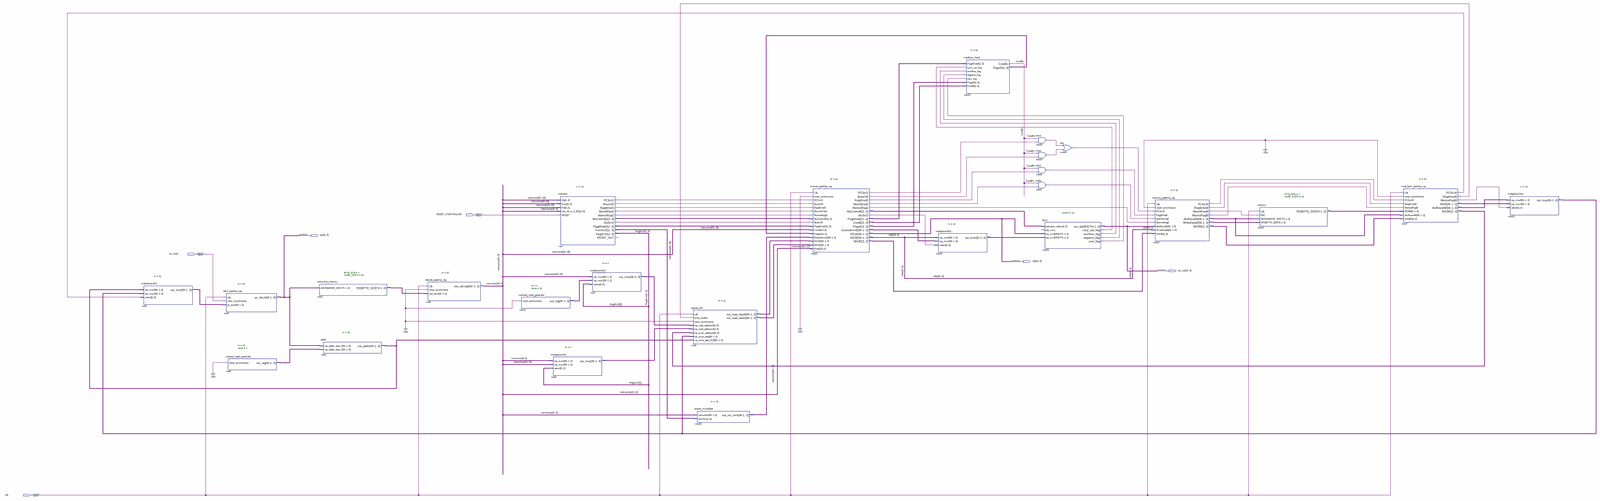
[diagram p0: schematic sheet, whole]
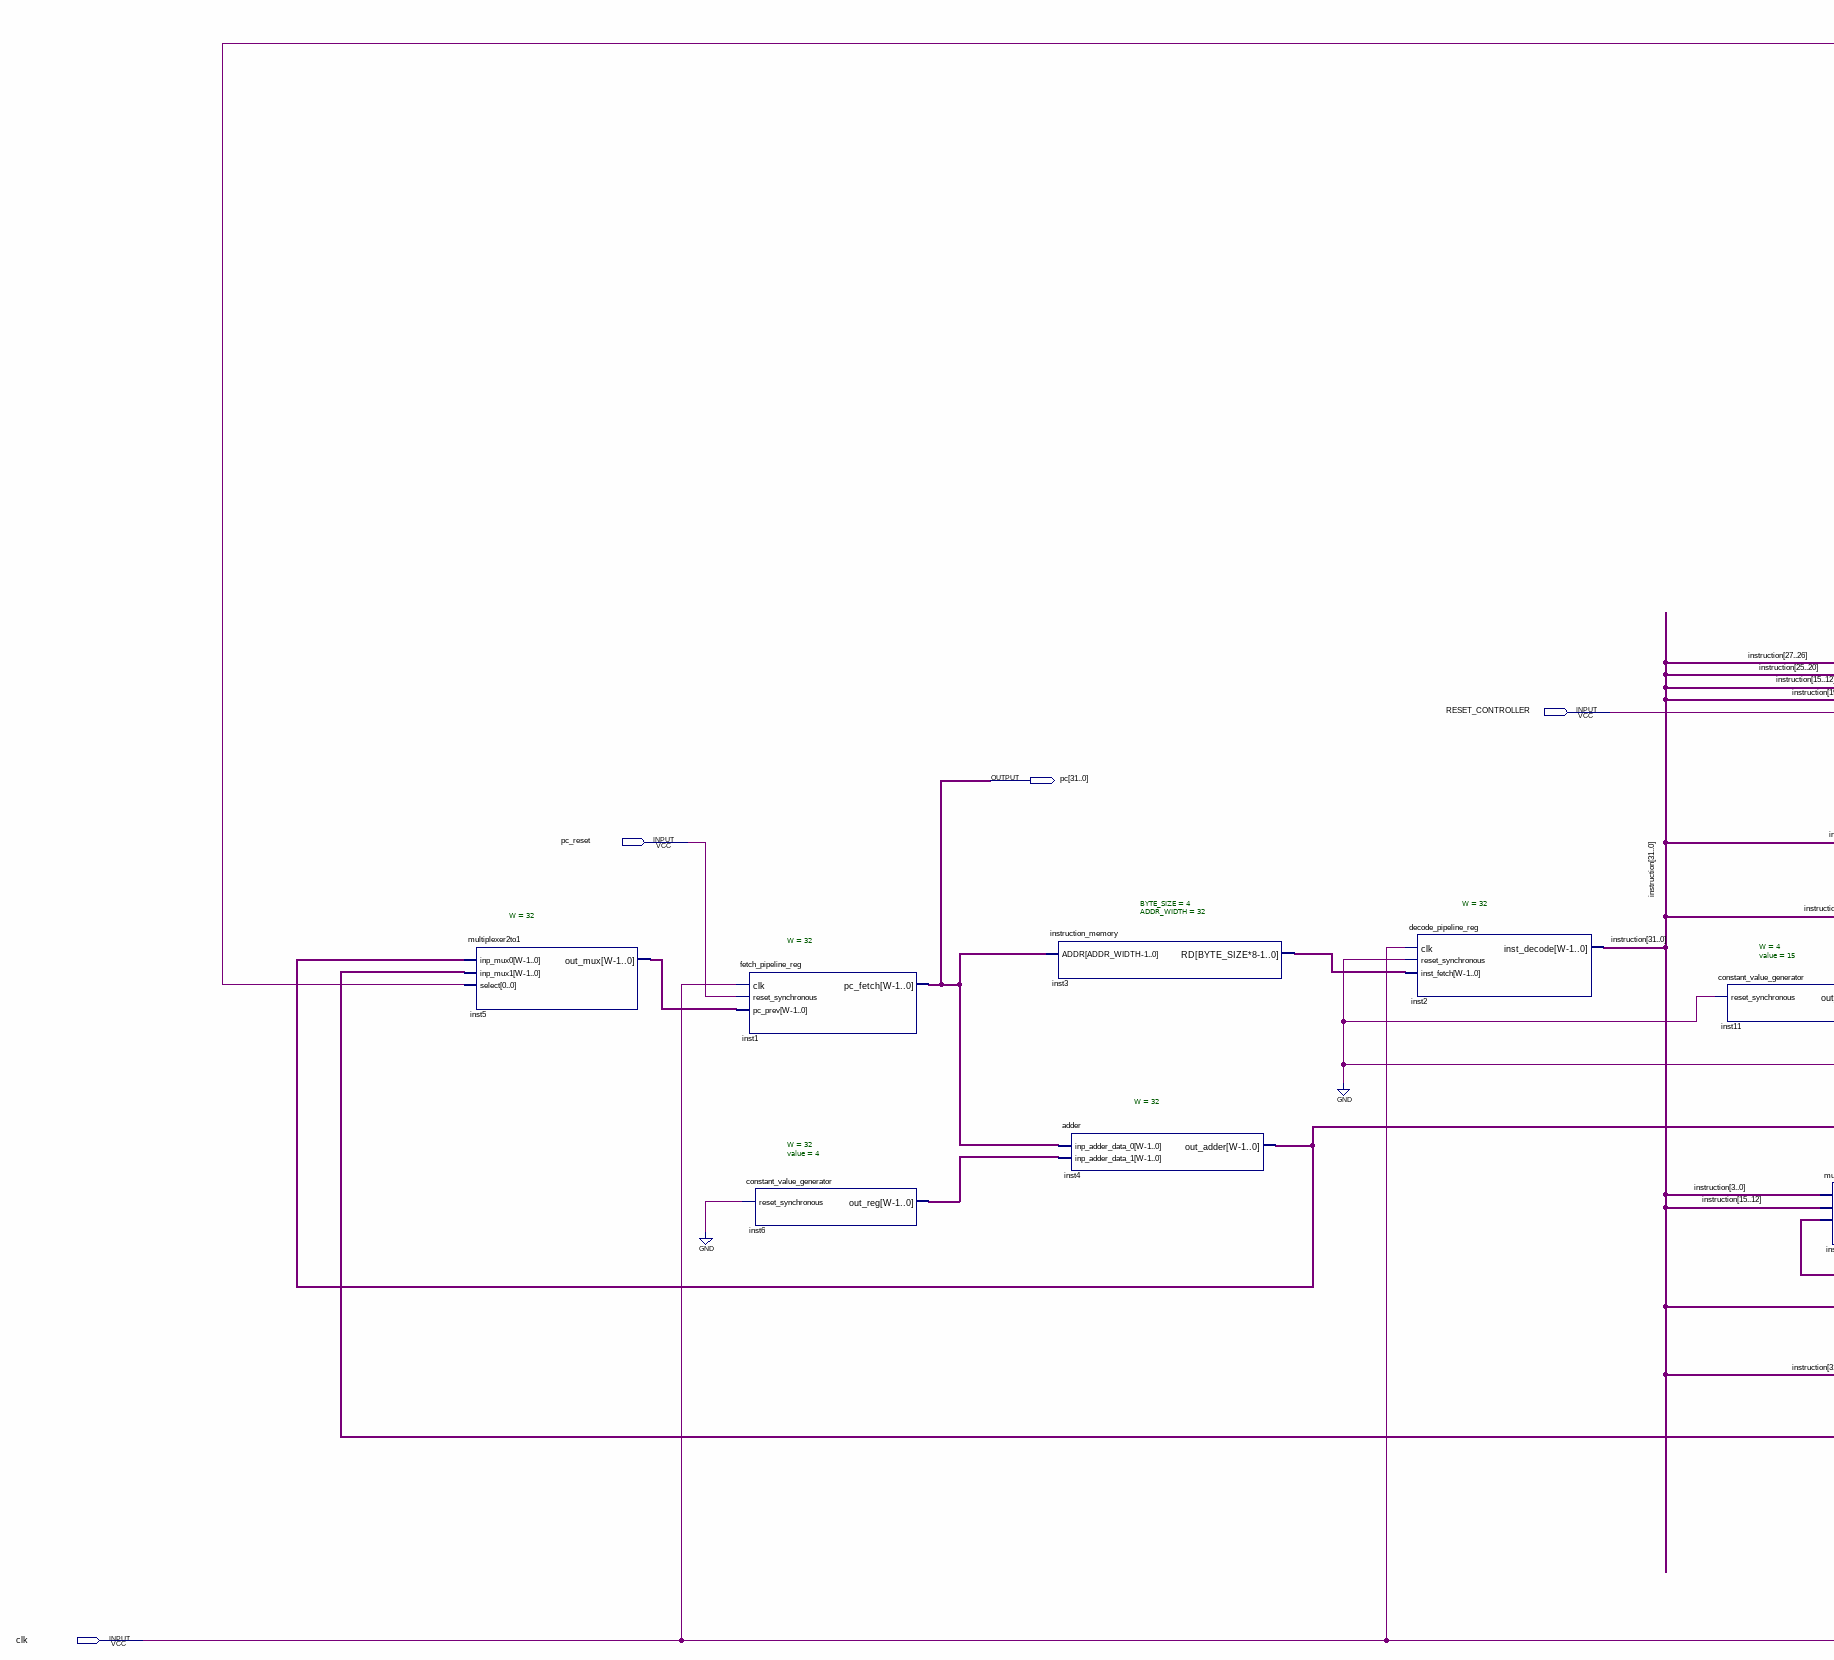
[diagram p1: schematic sheet, left part]
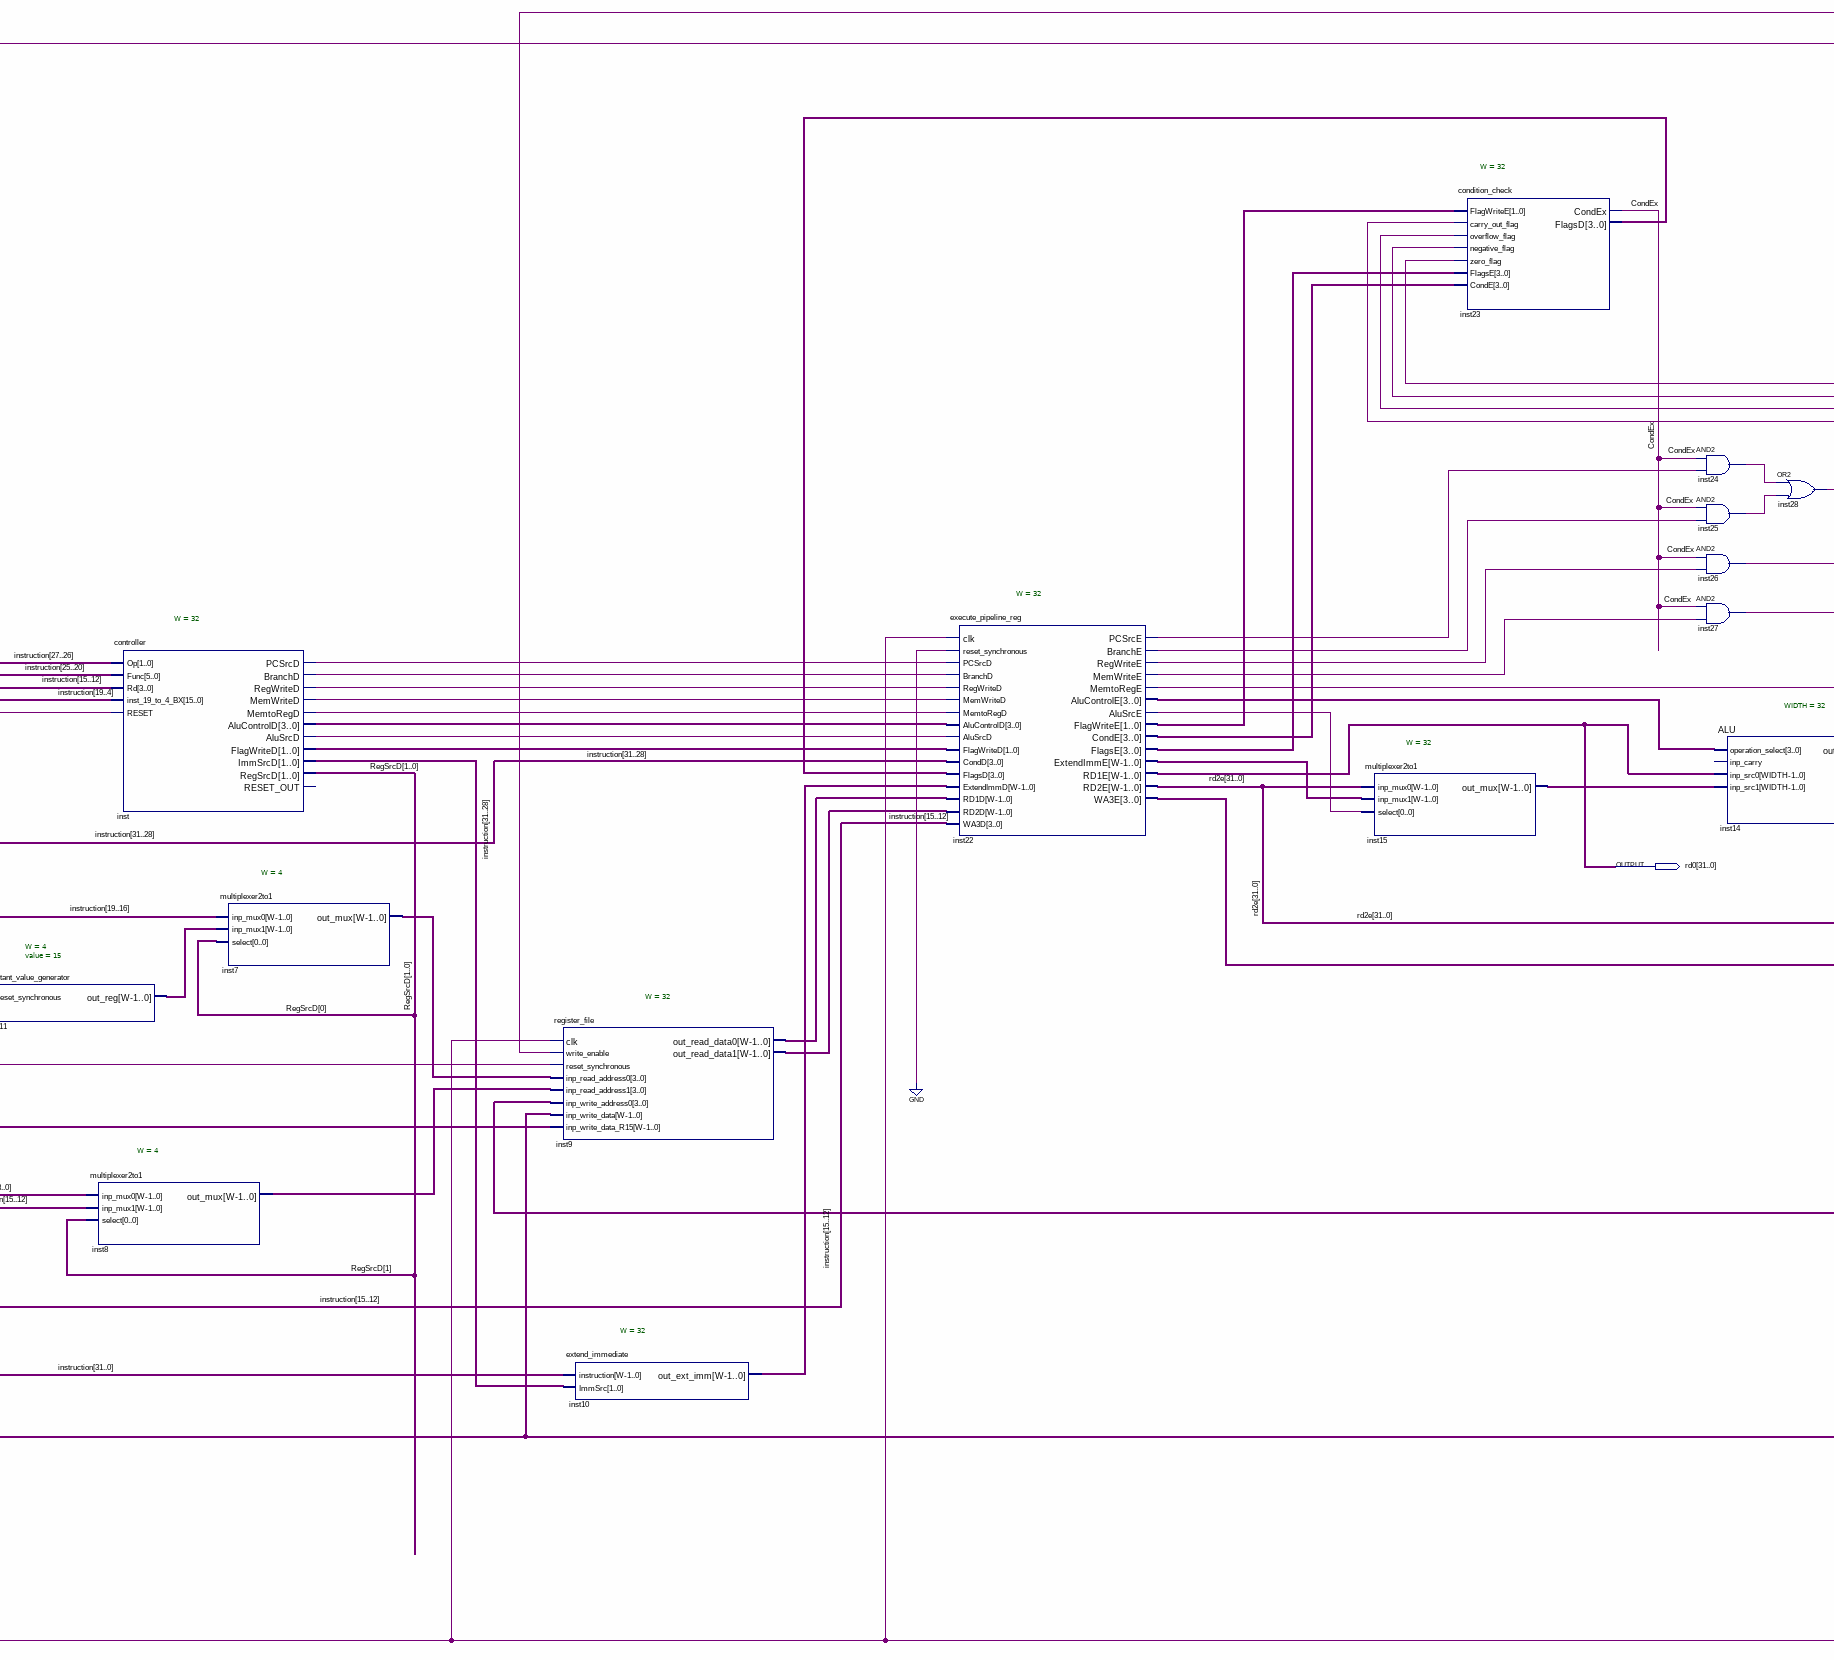
[diagram p2: schematic sheet, centre part]
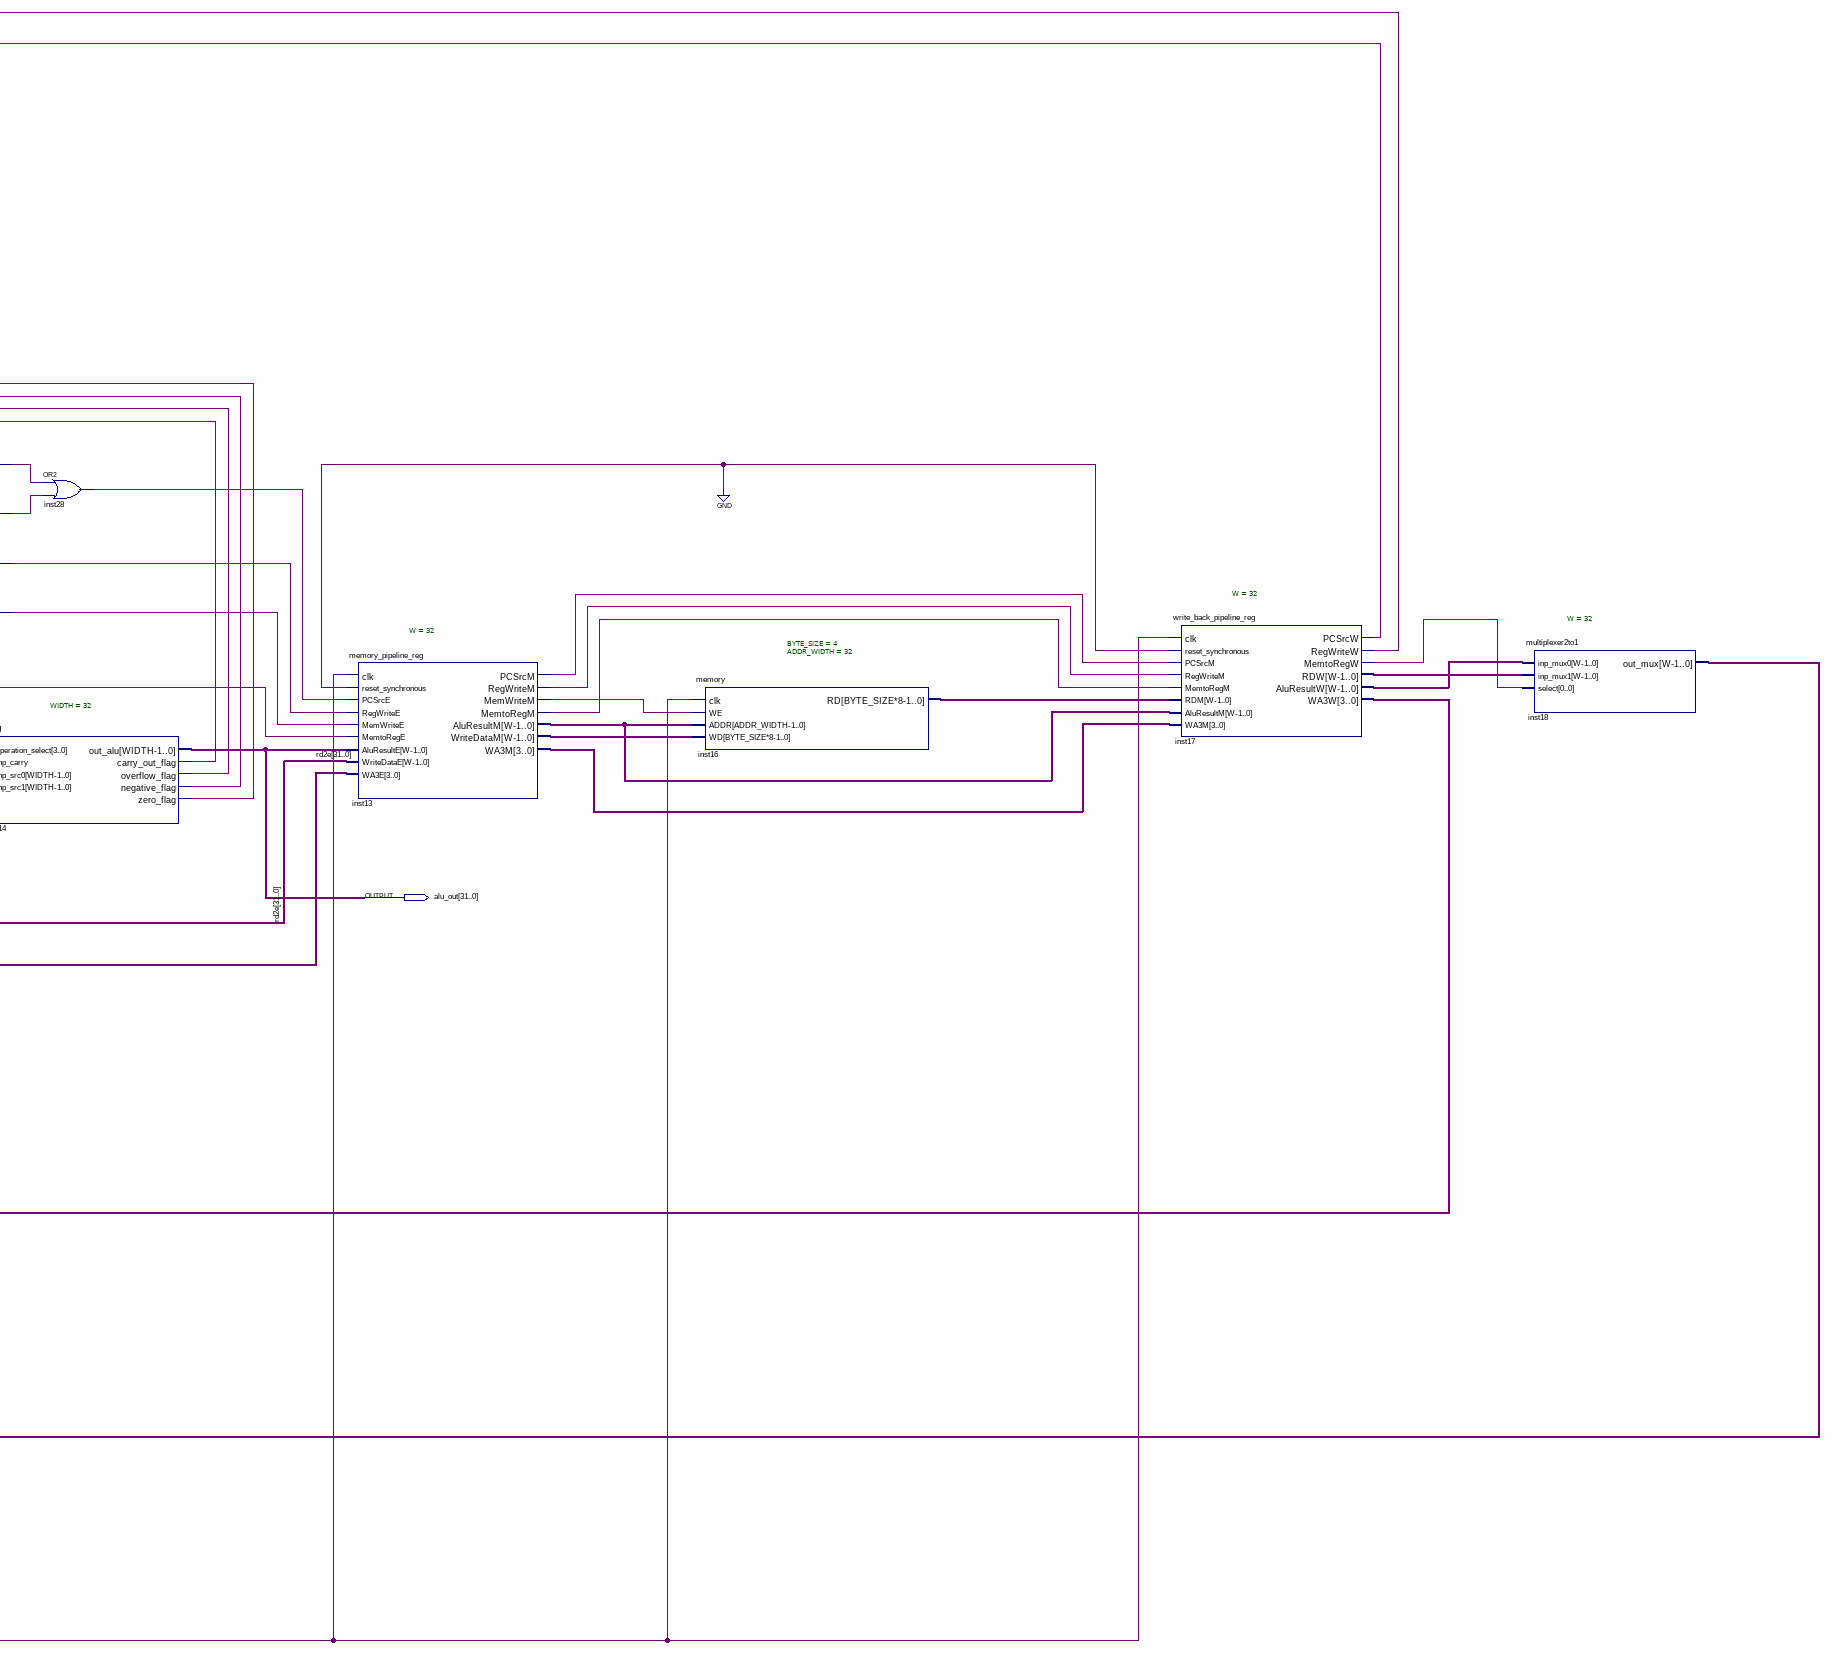
[diagram p3: schematic sheet, right part]
// Quartus schematic design_pipeline.bdf as structural Verilog: 25 symbols, 6 pins
module design_pipeline (
  input  RESET_CONTROLLER,
  input  pc_reset,
  input  clk,
  output [31:0] pc,
  output [31:0] rd0,
  output [31:0] alu_out
);

  wire CondEx, inst13_memtoregm, inst13_memwritem, inst13_pcsrcm, inst13_regwritem, inst14_carry_out_flag,
       inst14_negative_flag, inst14_overflow_flag, inst14_zero_flag, inst17_memtoregw, inst17_pcsrcw,
       inst17_regwritew, inst22_alusrce, inst22_branche, inst22_memtorege, inst22_memwritee, inst22_pcsrce,
       inst22_regwritee, inst24_out, inst25_out, inst26_out, inst27_out, inst28_out, inst_alusrcd,
       inst_branchd, inst_memtoregd, inst_memwrited, inst_pcsrcd, inst_regwrited;
  wire [1:0] inst22_flagwritee, inst_flagwrited, inst_immsrcd, RegSrcD;
  wire [3:0] inst7_out_mux, inst8_out_mux, inst11_out_reg, inst13_wa3m, inst17_wa3w, inst22_alucontrole,
       inst22_conde, inst22_flagse, inst22_wa3e, inst23_flagsd, inst_alucontrold;
  wire [31:0] inst3_rd, inst4_out_adder, inst5_out_mux, inst6_out_reg, inst9_out_read_data0,
       inst9_out_read_data1, inst10_out_ext_imm, inst13_aluresultm, inst13_writedatam, inst15_out_mux,
       inst16_rd, inst17_aluresultw, inst17_rdw, inst18_out_mux, inst22_extendimme, instruction, rd2e;

  multiplexer2to1 #(.W(32)) inst5 (
    .inp_mux0(inst4_out_adder), .inp_mux1(inst18_out_mux), .select(inst17_pcsrcw), .out_mux(inst5_out_mux));
  fetch_pipeline_reg #(.W(32)) inst1 (.clk(clk), .reset_synchronous(pc_reset), .pc_prev(inst5_out_mux), .pc_fetch(pc));
  constant_value_generator #(.W(32), .value(4)) inst6 (.reset_synchronous(1'b0), .out_reg(inst6_out_reg));
  instruction_memory #(.BYTE_SIZE(4), .ADDR_WIDTH(32)) inst3 (.ADDR(pc), .RD(inst3_rd));
  adder #(.W(32)) inst4 (.inp_adder_data_0(pc), .inp_adder_data_1(inst6_out_reg), .out_adder(inst4_out_adder));
  decode_pipeline_reg #(.W(32)) inst2 (
    .clk(clk), .reset_synchronous(1'b0), .inst_fetch(inst3_rd), .inst_decode(instruction));
  constant_value_generator #(.W(4), .value(15)) inst11 (.reset_synchronous(1'b0), .out_reg(inst11_out_reg));
  controller #(.W(32)) inst (
    .Op(instruction[27:26]), .Func(instruction[25:20]), .Rd(instruction[15:12]),
    .inst_19_to_4_BX(instruction[19:4]), .RESET(RESET_CONTROLLER), .PCSrcD(inst_pcsrcd),
    .BranchD(inst_branchd), .RegWriteD(inst_regwrited), .MemWriteD(inst_memwrited),
    .MemtoRegD(inst_memtoregd), .AluControlD(inst_alucontrold), .AluSrcD(inst_alusrcd),
    .FlagWriteD(inst_flagwrited), .ImmSrcD(inst_immsrcd), .RegSrcD(RegSrcD));  // open: RESET_OUT
  multiplexer2to1 #(.W(4)) inst8 (
    .inp_mux0(instruction[3:0]), .inp_mux1(instruction[15:12]), .select(RegSrcD[1]), .out_mux(inst8_out_mux));
  multiplexer2to1 #(.W(4)) inst7 (
    .inp_mux0(instruction[19:16]), .inp_mux1(inst11_out_reg), .select(RegSrcD[0]), .out_mux(inst7_out_mux));
  register_file #(.W(32)) inst9 (
    .clk(clk), .write_enable(inst17_regwritew), .reset_synchronous(1'b0), .inp_read_address0(inst7_out_mux),
    .inp_read_address1(inst8_out_mux), .inp_write_address0(inst17_wa3w), .inp_write_data(inst18_out_mux),
    .inp_write_data_R15(inst4_out_adder), .out_read_data0(inst9_out_read_data0),
    .out_read_data1(inst9_out_read_data1));
  extend_immediate #(.W(32)) inst10 (
    .instruction(instruction), .ImmSrc(inst_immsrcd), .out_ext_imm(inst10_out_ext_imm));
  execute_pipeline_reg #(.W(32)) inst22 (
    .clk(clk), .reset_synchronous(1'b0), .PCSrcD(inst_pcsrcd), .BranchD(inst_branchd),
    .RegWriteD(inst_regwrited), .MemWriteD(inst_memwrited), .MemtoRegD(inst_memtoregd),
    .AluControlD(inst_alucontrold), .AluSrcD(inst_alusrcd), .FlagWriteD(inst_flagwrited),
    .CondD(instruction[31:28]), .FlagsD(inst23_flagsd), .ExtendImmD(inst10_out_ext_imm),
    .RD1D(inst9_out_read_data0), .RD2D(inst9_out_read_data1), .WA3D(instruction[15:12]),
    .PCSrcE(inst22_pcsrce), .BranchE(inst22_branche), .RegWriteE(inst22_regwritee),
    .MemWriteE(inst22_memwritee), .MemtoRegE(inst22_memtorege), .AluControlE(inst22_alucontrole),
    .AluSrcE(inst22_alusrce), .FlagWriteE(inst22_flagwritee), .CondE(inst22_conde), .FlagsE(inst22_flagse),
    .ExtendImmE(inst22_extendimme), .RD1E(rd0), .RD2E(rd2e), .WA3E(inst22_wa3e));
  multiplexer2to1 #(.W(32)) inst15 (
    .inp_mux0(rd2e), .inp_mux1(inst22_extendimme), .select(inst22_alusrce), .out_mux(inst15_out_mux));
  condition_check #(.W(32)) inst23 (
    .FlagWriteE(inst22_flagwritee), .carry_out_flag(inst14_carry_out_flag),
    .overflow_flag(inst14_overflow_flag), .negative_flag(inst14_negative_flag), .zero_flag(inst14_zero_flag),
    .FlagsE(inst22_flagse), .CondE(inst22_conde), .CondEx(CondEx), .FlagsD(inst23_flagsd));
  and inst24 (inst24_out, CondEx, inst22_pcsrce);
  and inst25 (inst25_out, CondEx, inst22_branche);
  and inst26 (inst26_out, CondEx, inst22_regwritee);
  and inst27 (inst27_out, CondEx, inst22_memwritee);
  ALU #(.WIDTH(32)) inst14 (
    .operation_select(inst22_alucontrole), .inp_src0(rd0), .inp_src1(inst15_out_mux), .out_alu(alu_out),
    .carry_out_flag(inst14_carry_out_flag), .overflow_flag(inst14_overflow_flag),
    .negative_flag(inst14_negative_flag), .zero_flag(inst14_zero_flag));  // open: inp_carry
  or inst28 (inst28_out, inst24_out, inst25_out);
  memory_pipeline_reg #(.W(32)) inst13 (
    .clk(clk), .reset_synchronous(1'b0), .PCSrcE(inst28_out), .RegWriteE(inst26_out), .MemWriteE(inst27_out),
    .MemtoRegE(inst22_memtorege), .AluResultE(alu_out), .WriteDataE(rd2e), .WA3E(inst22_wa3e),
    .PCSrcM(inst13_pcsrcm), .RegWriteM(inst13_regwritem), .MemWriteM(inst13_memwritem),
    .MemtoRegM(inst13_memtoregm), .AluResultM(inst13_aluresultm), .WriteDataM(inst13_writedatam),
    .WA3M(inst13_wa3m));
  memory #(.BYTE_SIZE(4), .ADDR_WIDTH(32)) inst16 (
    .clk(clk), .WE(inst13_memwritem), .ADDR(inst13_aluresultm), .WD(inst13_writedatam), .RD(inst16_rd));
  write_back_pipeline_reg #(.W(32)) inst17 (
    .clk(clk), .reset_synchronous(1'b0), .PCSrcM(inst13_pcsrcm), .RegWriteM(inst13_regwritem),
    .MemtoRegM(inst13_memtoregm), .RDM(inst16_rd), .AluResultM(inst13_aluresultm), .WA3M(inst13_wa3m),
    .PCSrcW(inst17_pcsrcw), .RegWriteW(inst17_regwritew), .MemtoRegW(inst17_memtoregw), .RDW(inst17_rdw),
    .AluResultW(inst17_aluresultw), .WA3W(inst17_wa3w));
  multiplexer2to1 #(.W(32)) inst18 (
    .inp_mux0(inst17_aluresultw), .inp_mux1(inst17_rdw), .select(inst17_memtoregw), .out_mux(inst18_out_mux));
endmodule
